# Altium schematic sheet Модуль STM32F103RBT6.SchDoc
size 420 x 297 mm; SheetNumber: 1; SheetTotal: 1
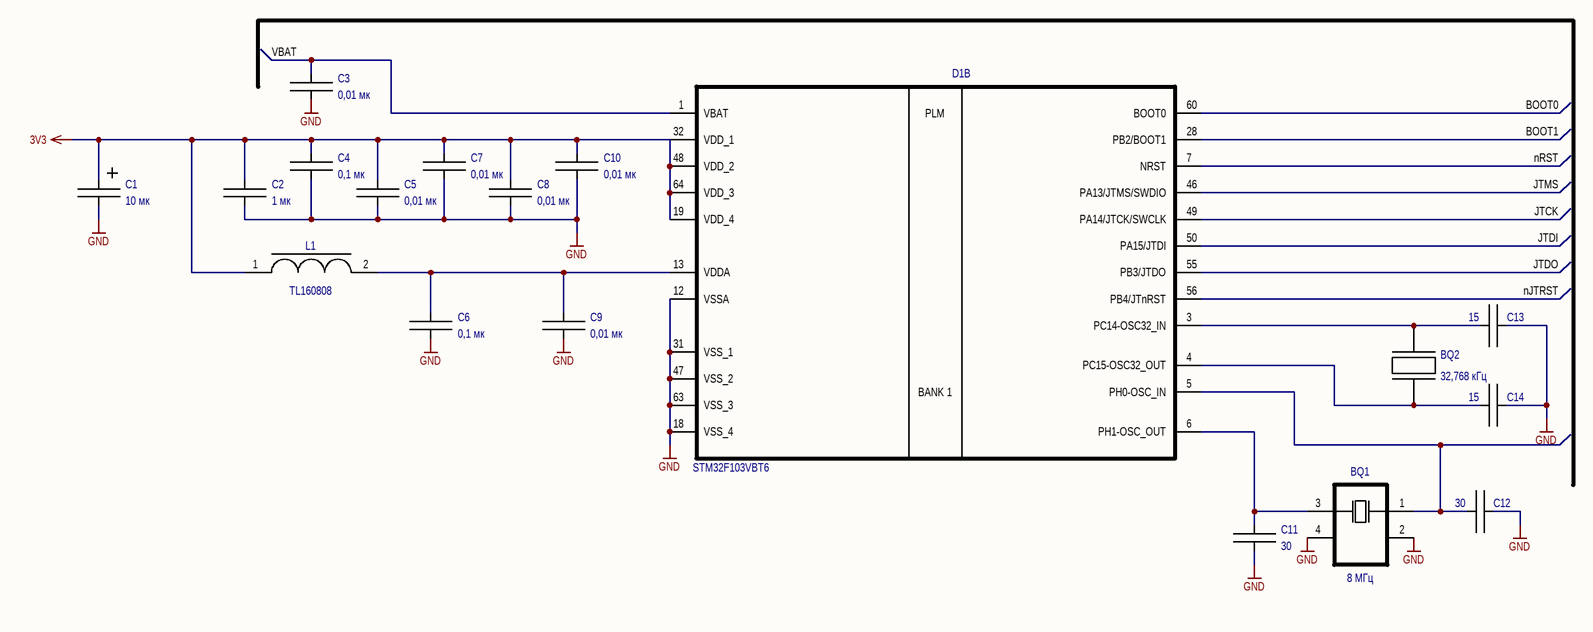
[diagram p0: Модуль STM32F103RBT6.SchDoc]

## Parts
BQ1  value 8 МГц  [SMD3225_4P20MHZ20PF10PPM]  (hidden comment: кварцевый резонатор_1)
BQ2  value 32,768 кГц  [SMD3215_2P32768KHZ125PF10PPM]  (hidden comment: 3215)
C1  value 10 мк  [K53-68_3216(A)]  (hidden comment: A-case)
C2  value 1 мк  [K10-69B_2.0_1.25(0805)]  (hidden comment: 0805)
C3  value 0,01 мк  [K10-79_1.6_0.8(0603)]  (hidden comment: 0603)
C4  value 0,1 мк  [K10-79_1.6_0.8(0603)]  (hidden comment: 0603)
C5  value 0,01 мк  [K10-79_1.6_0.8(0603)]  (hidden comment: 0603)
C6  value 0,1 мк  [K10-79_1.6_0.8(0603)]  (hidden comment: 0603)
C7  value 0,01 мк  [K10-79_1.6_0.8(0603)]  (hidden comment: 0603)
C8  value 0,01 мк  [K10-79_1.6_0.8(0603)]  (hidden comment: 0603)
C9  value 0,01 мк  [K10-79_1.6_0.8(0603)]  (hidden comment: 0603)
C10  value 0,01 мк  [K10-79_1.6_0.8(0603)]  (hidden comment: 0603)
C11  value 30  [K10-79_1.6_0.8(0603)]  (hidden comment: 0603)
C12  value 30  [K10-79_1.6_0.8(0603)]  (hidden comment: 0603)
C13  value 15  [K10-79_1.6_0.8(0603)]  (hidden comment: 0603)
C14  value 15  [K10-79_1.6_0.8(0603)]  (hidden comment: 0603)
D1  value STM32F103VBT6  [QFP50P1200X1200X160-64N]  (part B of 2)
L1  value TL160808  [742792651]  (hidden comment: 0603)

## Nets
3V3: C1.1 C2.2 C4.2 C5.2 C7.2 C8.2 C10.2 D1.19(VDD_4) D1.32(VDD_1) D1.48(VDD_2) D1.64(VDD_3) L1.1
GND: BQ1.2(GND) BQ1.4(GND) C1.2 C2.1 C3.1 C4.1 C5.1 C6.1 C7.1 C8.1 C9.1 C10.1 C11.1 C12.1 C13.1 C14.1 D1.12(VSSA) D1.18(VSS_4) D1.31(VSS_1) D1.47(VSS_2) D1.63(VSS_3)
BOOT0: D1.60(BOOT0)
BOOT1: D1.28(PB2/BOOT1)
JTCK: D1.49(PA14/JTCK/SWCLK)
JTDI: D1.50(PA15/JTDI)
JTDO: D1.55(PB3/JTDO)
JTMS: D1.46(PA13/JTMS/SWDIO)
nJTRST: D1.56(PB4/JTnRST)
nRST: D1.7(NRST)
VBAT: C3.2 D1.1(VBAT)
NetBQ1_1: BQ1.1 C12.2 D1.5(PH0-OSC_IN)
NetBQ1_3: BQ1.3 C11.2 D1.6(PH1-OSC_OUT)
NetBQ2_1: BQ2.1(IN) C13.2 D1.3(PC14-OSC32_IN)
NetBQ2_2: BQ2.2(GND) C14.2 D1.4(PC15-OSC32_OUT)
NetC6_2: C6.2 C9.2 D1.13(VDDA) L1.2

## Notes on the sheet
- Перв.примен.
- Справ. №
- Подп. и дата
- Инв.№ дубл.
- Взам. инв. №
- Изм.
- Лист
- № докум.
- Подп.
- Дата
- Лит.
- Масса
- Масштаб
- Пров.
- Т.контр
- Разраб.
- Схема электрическая принципиальная
- 1
- Листов
- Инв № подл.
- Н.контр.
- Утв.
- Копировал
- Формат А3
- (in symbol STM32F103RBT6, part B) PLM; BANK 1

## Library data of the parts
BQ1 = кварцевый резонатор_1: PartNumber: MQ-12.000-18; Company: Mercury; Package: 0705
BQ2 = кварцевый резонатор: PartNumber: 32,768 кГц 3215 SMD; Company: Mercury; Package: 3215
C1 = C+: Company: *; Tolerance: *; Voltage: *; Type: *; PartNumber: *; Package: A-case
C2-C14 = C: Company: *; PartNumber: *; Tolerance: *; Voltage: *; Type: *
  C2: Package: 0805
  C3-C14: Package: 0603
D1 = STM32F103RBT6: Company: Xilinx; PurtNamber: XC6SLX25-2FGG484C; Package: LQFP-48
L1 = SH6028-5R0YLB: Company: ABC Electronics Group; CurrentMax: 2,4А; PartNumber: TL160808; Package: 0603